# EAGLE design SAMD51_SoundHub_Pro_1.0.0_may2023 (EAGLE 9.6.2)
COMPANY: ADAFRUIT INDUSTRIES; DRAWN: KTOWN; REV: B

## Sheet 1 of 3
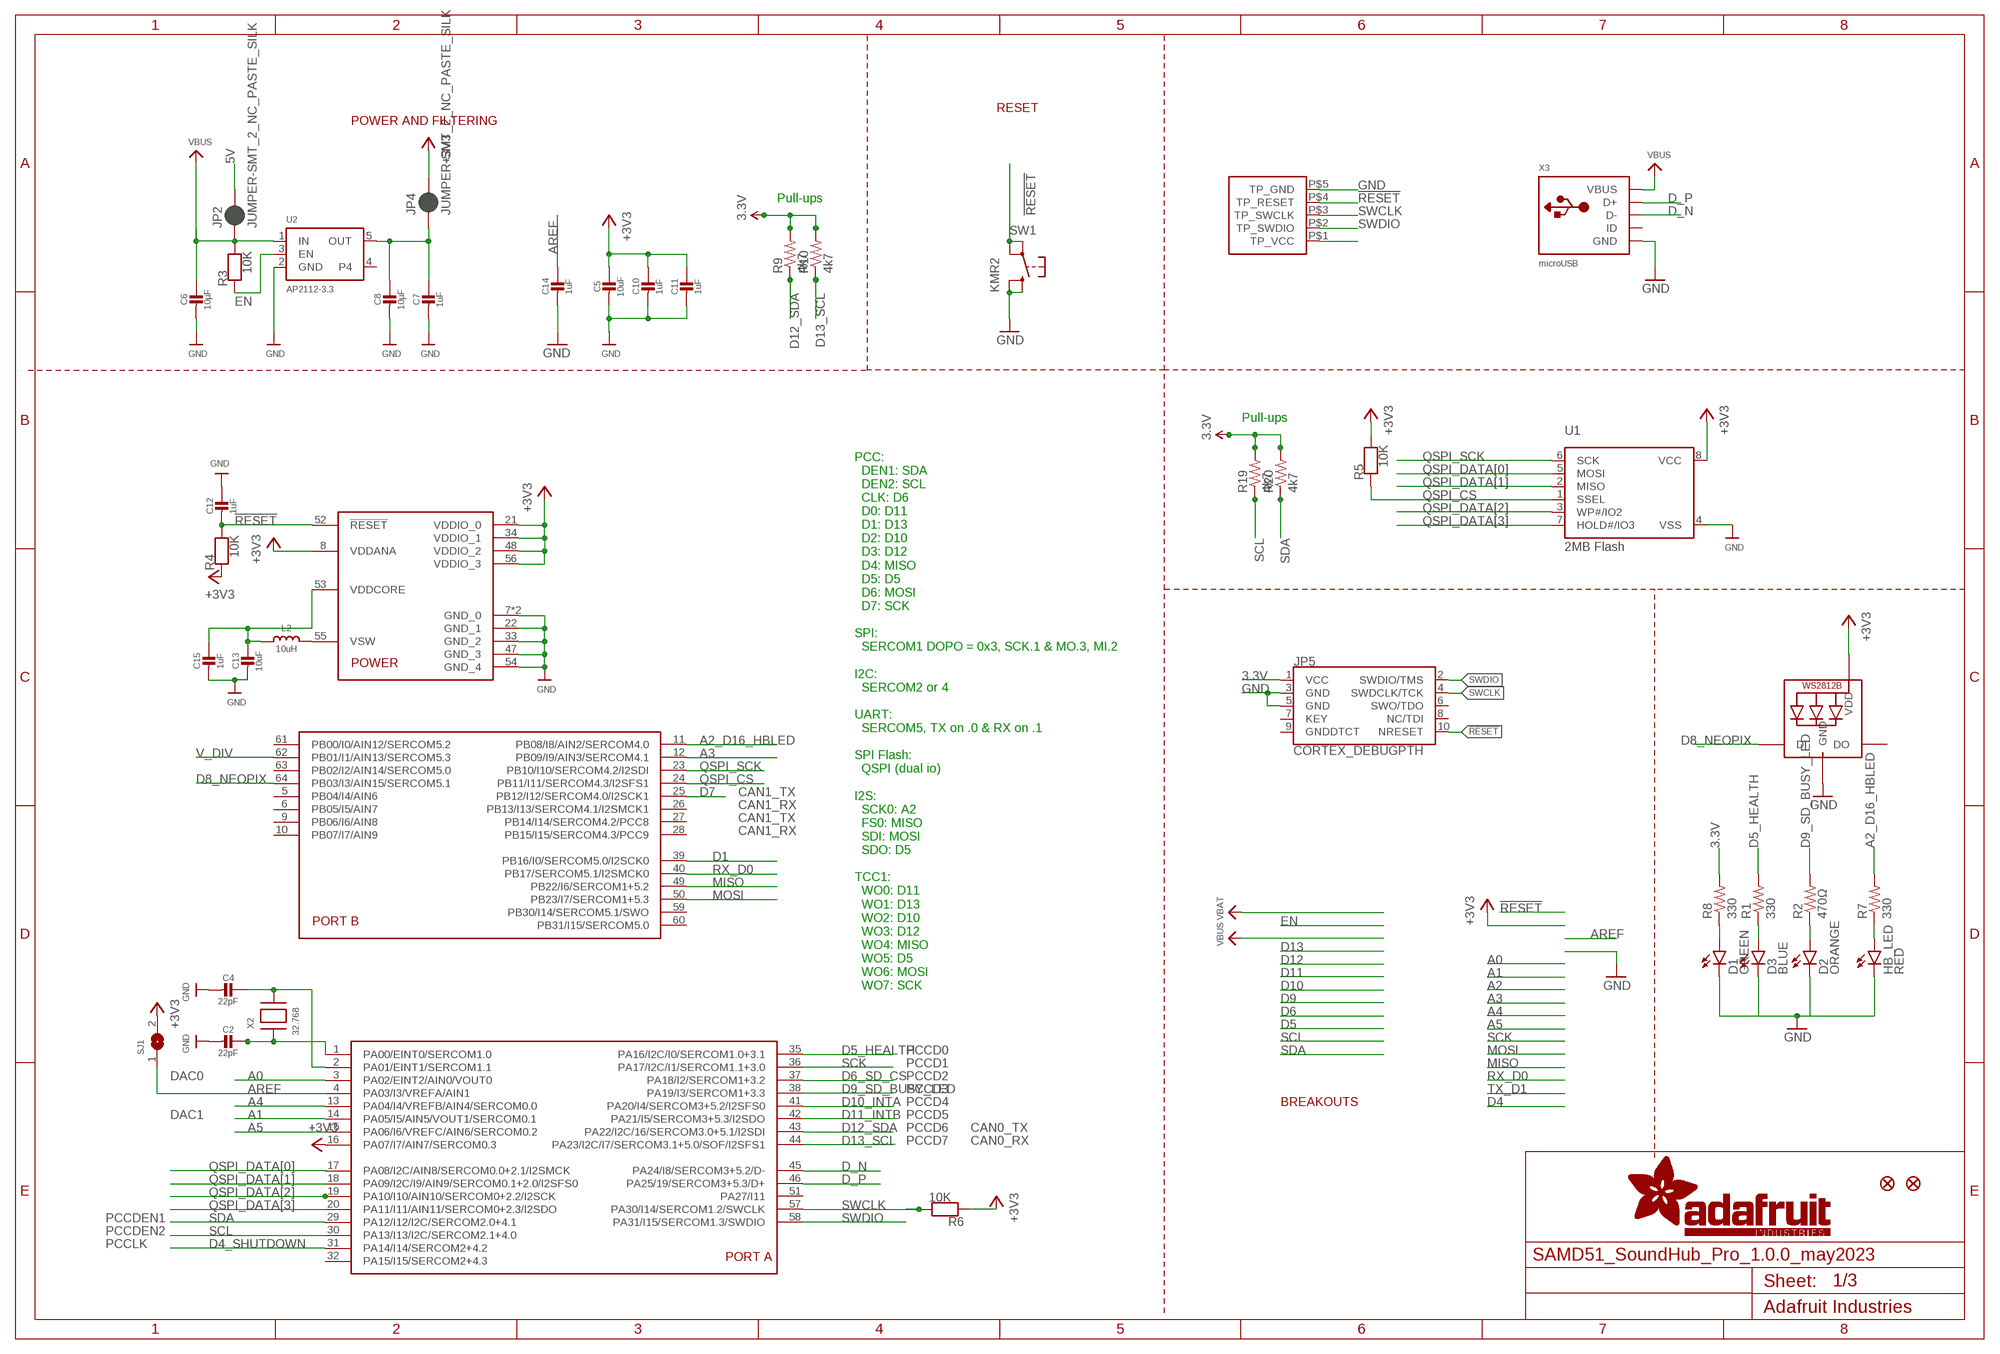
[diagram p0: schematic, sheet 1]

### Parts
C2  22pF  CAP_CERAMIC0603_NO  [0603-NO]
C4  22pF  CAP_CERAMIC0603_NO  [0603-NO]
C5  10uF  CAP_CERAMIC0805-NOOUTLINE  [0805-NO]
C6  10µF  CAP_CERAMIC0805-NOOUTLINE  [0805-NO]
C7  1uF  CAP_CERAMIC0603_NO  [0603-NO]
C8  10µF  CAP_CERAMIC0805-NOOUTLINE  [0805-NO]
C10  1uF  CAP_CERAMIC0603_NO  [0603-NO]
C11  1uF  CAP_CERAMIC0603_NO  [0603-NO]
C12  1uF  CAP_CERAMIC0603_NO  [0603-NO]
C13  10uF  CAP_CERAMIC0805-NOOUTLINE  [0805-NO]
C14  1uF  CAP_CERAMIC0603_NO  [0603-NO]
C15  1uF  CAP_CERAMIC0603_NO  [0603-NO]
D1  GREEN  LED-BLUE0603  [LED-0603@1]
D2  ORANGE  LED-RED0603  [LED-0603]
D3  BLUE  LED-BLUE0603  [LED-0603@1]
HB_LED  RED  LED-RED0603  [LED-0603]
JP2  JUMPER-SMT_2_NC_PASTE_SILK  [SMT-JUMPER_2_NC_PASTE_SILK]
JP4  JUMPER-SMT_2_NC_PASTE_SILK  [SMT-JUMPER_2_NC_PASTE_SILK]
JP5  CORTEX_DEBUGPTH  [2X5-PTH-1.27MM]
L2  10uH  INDUCTOR  [INDUCTOR_1007]
LED1  WS2812B3535  [LED3535]
R1  330  330OHM1/10W1%(0603)  [0603-RES]
R2  470Ω  330OHM1/10W1%(0603)  [0603-RES]
R3  10K  RESISTOR_0603_NOOUT  [0603-NO]
R4  10K  RESISTOR_0603_NOOUT  [0603-NO]
R5  10K  RESISTOR_0603_NOOUT  [0603-NO]
R6  10K  RESISTOR_0603_NOOUT  [0603-NO]
R7  330  330OHM1/10W1%(0603)  [0603-RES]
R8  330  330OHM1/10W1%(0603)  [0603-RES]
R9  4k7  47KOHM1/10W1%(0603)  [0603-RES]
R10  4k7  47KOHM1/10W1%(0603)  [0603-RES]
R19  4k7  47KOHM1/10W1%(0603)  [0603-RES]
R20  4k7  47KOHM1/10W1%(0603)  [0603-RES]
SJ1  SOLDERJUMPERCLOSED  [SOLDERJUMPER_CLOSEDWIRE]
SW1  KMR2  SWITCH_TACT_SMT4.6X2.8  [BTN_KMR2_4.6X2.8]
U1  2MB Flash  SPIFLASH_8PINUX  [USON8]
U2  AP2112-3.3  VREG_SOT23-5  [SOT23-5]
U$12  HUB_TESTPINSHUBS  [TEST_PINS]
U$14  ATSAMD51J  [PQFN64-1]
U$34  FIDUCIAL_1MM  [FIDUCIAL_1MM]
U$35  FIDUCIAL_1MM  [FIDUCIAL_1MM]
X2  32.768  XTAL-3.2X1.5  [XTAL3215]
X3  microUSB  USB_MICRO_20329_V2  [4UCONN_20329_V2]

### Nets
3.3V: C5.1 C10.1 C11.1 JP4.2 JP5.1(VCC) LED1.2(VDD) R4.1 R5.2 R6.1 R8.2 R9.2 R10.2 R19.2 R20.2 SJ1.2 U1.8(VCC) U$12.P$1(TP_VCC) U$14.8(VDDANA) U$14.16(PA07/I7/AIN7/SERCOM0.3) U$14.21(VDDIO_0) U$14.34(VDDIO_1) U$14.48(VDDIO_2) U$14.56(VDDIO_3) ; supply symbol labelled +3V3 ; also sheet 2
5V: JP2.2 ; also sheet 2
!RESET: C12.2 JP5.10(NRESET) R4.2 SW1.A'(P1) SW1.A(P) U$12.P$4(TP_RESET) U$14.52(!RESET)
A0: U$14.3(PA02/EINT2/AIN0/VOUT0) ; also sheet 2
A1: U$14.14(PA05/I5/AIN5/VOUT1/SERCOM0.1) ; also sheet 2
A2_D16_HBLED: R7.2 U$14.11(PB08/I8/AIN2/SERCOM4.0)
A3: U$14.12(PB09/I9/AIN3/SERCOM4.1)
A4: U$14.13(PA04/I4/VREFB/AIN4/SERCOM0.0)
A5: U$14.15(PA06/I6/VREFC/AIN6/SERCOM0.2)
AREF: C14.1 SJ1.1 U$14.4(PA03/I3/VREFA/AIN1)
D1: U$14.39(PB16/I0/SERCOM5.0/I2SCK0)
D4_SHUTDOWN: U$14.31(PA14/I14/SERCOM2+4.2) ; also sheet 2
D5_HEALTH: R1.2 U$14.35(PA16/I2C/I0/SERCOM1.0+3.1)
D5_HEALTH_LED: D3.A R1.1
D5_HEALTH_LED1: D1.A R8.1
D6_SD_CS: U$14.37(PA18/I2/SERCOM1+3.2) ; also sheet 2
D7: U$14.25(PB12/I12/SERCOM4.0/I2SCK1) ; also sheet 2
D8_NEOPIX: LED1.1(DI) U$14.64(PB03/I3/AIN15/SERCOM5.1)
D9_SD_BUSY_LED: R2.2 U$14.38(PA19/I3/SERCOM1+3.3)
D10_INTA: U$14.41(PA20/I4/SERCOM3+5.2/I2SFS0) ; also sheet 2
D11_INTB: U$14.42(PA21/I5/SERCOM3+5.3/I2SDO) ; also sheet 2
D12_SDA: R9.1 U$14.43(PA22/I2C/16/SERCOM3.0+5.1/I2SDI) ; also sheet 2
D13_SCL: R10.1 U$14.44(PA23/I2C/I7/SERCOM3.1+5.0/SOF/I2SFS1) ; also sheet 2
D14_HB_LED: HB_LED.A R7.1
D_N: U$14.45(PA24/I8/SERCOM3+5.2/D-) X3.D-
D_P: U$14.46(PA25/19/SERCOM3+5.3/D+) X3.D+
EN: R3.1 U2.3(EN)
GND [gnd]: C2.2 C4.2 C5.2 C6.2 C7.2 C8.2 C10.2 C11.2 C12.1 C13.2 C14.2 C15.2 D1.C HB_LED.C JP5.3(GND) JP5.5(GND) LED1.4(GND) SW1.B'(S1) SW1.B(S) U1.4(VSS) U2.2(GND) U$12.P$5(TP_GND) U$14.7(GND_0) U$14.22(GND_1) U$14.33(GND_2) U$14.47(GND_3) U$14.54(GND_4) U$14.EXP(GND_0) X3.BASE@1(GND) X3.BASE@2(GND) X3.GND X3.SPRT@1(GND) X3.SPRT@2(GND) X3.SPRT@3(GND) X3.SPRT@4(GND) ; also sheet 2
MISO: U$14.49(PB22/I6/SERCOM1+5.2) ; also sheet 2
MOSI: U$14.50(PB23/I7/SERCOM1+5.3) ; also sheet 2
N$1: D2.A R2.1
N$3: D3.C
N$5: C2.1 U$14.1(PA00/EINT0/SERCOM1.0) X2.P$1
N$6: D2.C
N$7: C4.1 U$14.2(PA01/EINT1/SERCOM1.1) X2.P$2
N$11: L2.P$2 U$14.55(VSW)
OUT [power]: C7.1 C8.1 JP4.1 U2.5(OUT)
QSPI_CS: R5.1 U1.1(SSEL) U$14.24(PB11/I11/SERCOM4.3/I2SFS1)
QSPI_DATA[0]: U1.5(MOSI) U$14.17(PA08/I2C/AIN8/SERCOM0.0+2.1/I2SMCK)
QSPI_DATA[1]: U1.2(MISO) U$14.18(PA09/I2C/I9/AIN9/SERCOM0.1+2.0/I2SFS0)
QSPI_DATA[2]: U1.3(WP#/IO2) U$14.19(PA10/I10/AIN10/SERCOM0+2.2/I2SCK)
QSPI_DATA[3]: U1.7(HOLD#/IO3) U$14.20(PA11/I11/AIN11/SERCOM0+2.3/I2SDO)
QSPI_SCK: U1.6(SCK) U$14.23(PB10/I10/SERCOM4.2/I2SDI)
RX_D0: U$14.40(PB17/SERCOM5.1/I2SMCK0)
SCK: U$14.36(PA17/I2C/I1/SERCOM1.1+3.0) ; also sheet 2
SCL: R19.1 U$14.30(PA13/I13/I2C/SERCOM2.1+4.0) ; also sheet 2
SDA: R20.1 U$14.29(PA12/I12/I2C/SERCOM2.0+4.1) ; also sheet 2
SWCLK: JP5.4(SWDCLK/TCK) R6.2 U$12.P$3(TP_SWCLK) U$14.57(PA30/I14/SERCOM1.2/SWCLK)
SWDIO: JP5.2(SWDIO/TMS) U$12.P$2(TP_SWDIO) U$14.58(PA31/I15/SERCOM1.3/SWDIO)
V_DIV: U$14.62(PB01/I1/AIN13/SERCOM5.3)
VBUS [power]: C6.1 JP2.1 R3.2 U2.1(IN) X3.VBUS
VDDCORE1: C13.1 C15.1 L2.P$1 U$14.53(VDDCORE)
Unconnected: JP5.6(SWO/TDO) JP5.7(KEY) JP5.8(NC/TDI) JP5.9(GNDDTCT) LED1.3(DO) U2.4 U$14.5(PB04/I4/AIN6) U$14.6(PB05/I5/AIN7) U$14.9(PB06/I6/AIN8) U$14.10(PB07/I7/AIN9) U$14.26(PB13/I13/SERCOM4.1/I2SMCK1) U$14.27(PB14/I14/SERCOM4.2/PCC8) U$14.28(PB15/I15/SERCOM4.3/PCC9) U$14.32(PA15/I15/SERCOM2+4.3) U$14.51(PA27/I11) U$14.59(PB30/I14/SERCOM5.1/SWO) U$14.60(PB31/I15/SERCOM5.0) U$14.61(PB00/I0/AIN12/SERCOM5.2) U$14.63(PB02/I2/AIN14/SERCOM5.0) X3.ID

### Notes on the sheet
- RESET
- POWER AND FILTERING
- Pull-ups
- Pull-ups
- CAN1_TX
- CAN1_RX
- CAN1_TX
- CAN1_RX
- PCC:
    DEN1: SDA
    DEN2: SCL
    CLK: D6
    D0: D11
    D1: D13
    D2: D10
    D3: D12
    D4: MISO
    D5: D5
    D6: MOSI
    D7: SCK
  
  SPI:
    SERCOM1 DOPO = 0x3, SCK.1 & MO.3, MI.2
  
  I2C:
    SERCOM2 or 4
  
  UART:
    SERCOM5, TX on .0 & RX on .1
  
  SPI Flash:
    QSPI (dual io)
  
  I2S:
    SCK0: A2
    FS0: MISO
    SDI: MOSI
    SDO: D5
  
  TCC1:
    WO0: D11
    WO1: D13
    WO2: D10
    WO3: D12
    WO4: MISO
    WO5: D5
    WO6: MOSI
    WO7: SCK
- PCCD0
- PCCD1
- DAC0 | PCCD2
- PCCD3
- PCCD4 | BREAKOUTS
- DAC1 | PCCD5
- PCCD6 | CAN0_TX
- PCCD7 | CAN0_RX
- PCCDEN1
- PCCDEN2
- PCCLK

## Sheet 2 of 3
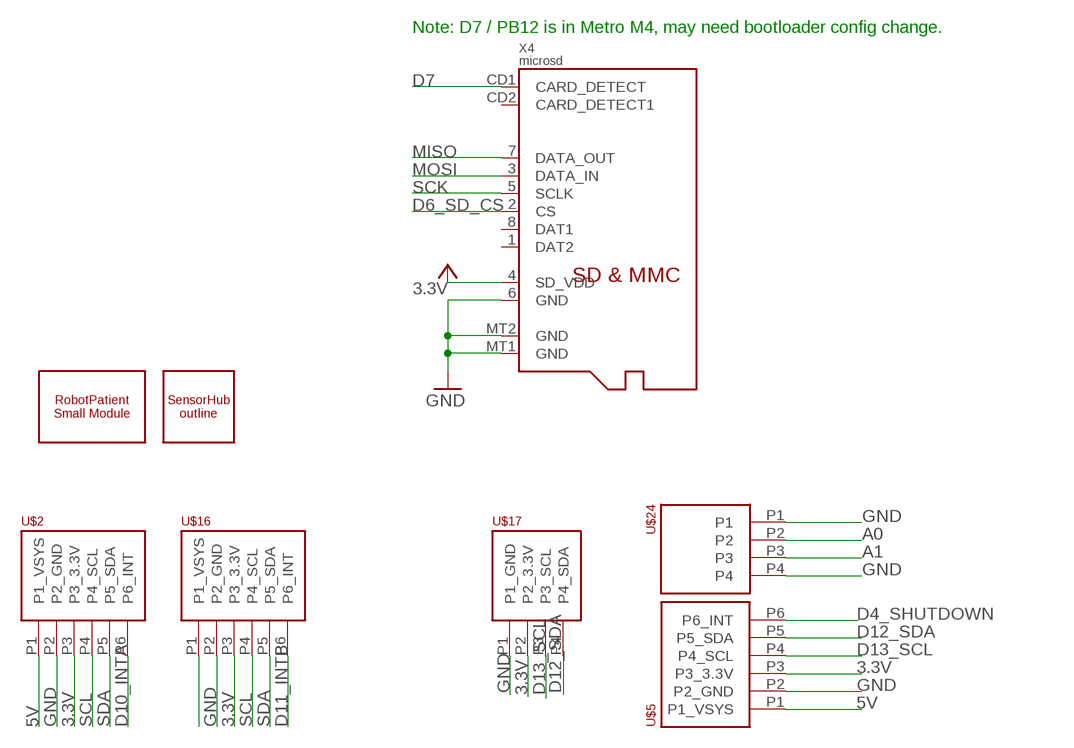
[diagram p1: schematic, sheet 2]

### Parts
U$2  PHOENIX_PTSM_M6_TH_I2CPPANGLE  [PTSM_M6_THRHOLE]
U$5  PHOENIX_PTSM_M6_TH_I2CPPANGLE  [PTSM_M6_THRHOLE]
U$7  SENSORHUB_PROFILEUSB_LEFT  [SENSORHUB_OUTLINE_USB_NOTCH_LEFT]
U$9  ROBOTPATIENT_SMALL_MODULEOUTLINE  [ROBOTPATIENT_SMALL]
U$16  PHOENIX_PTSM_M6_TH_I2CPPANGLE  [PTSM_M6_THRHOLE]
U$17  PHOENIX_PTSM_M4_THANGLE  [PTSM_M4_TH]
U$24  PHOENIX_PTSM_M4_TH_ANGLE  [PTSM_M4_TH_ANGLE_NEUTRAL]
X4  microsd  MICROSD  [MICROSD]

### Nets
3.3V: U$2.P3(P3_3.3V) U$5.P3(P3_3.3V) U$16.P3(P3_3.3V) U$17.P2(P2_3.3V) X4.4(SD_VDD) ; supply symbol labelled +3V3 ; also sheet 1
5V: U$2.P1(P1_VSYS) U$5.P1(P1_VSYS) U$16.P1(P1_VSYS) ; also sheet 1
A0: U$24.P2 ; also sheet 1
A1: U$24.P3 ; also sheet 1
D4_SHUTDOWN: U$5.P6(P6_INT) ; also sheet 1
D6_SD_CS: X4.2(CS) ; also sheet 1
D7: X4.CD1(CARD_DETECT) ; also sheet 1
D10_INTA: U$2.P6(P6_INT) ; also sheet 1
D11_INTB: U$16.P6(P6_INT) ; also sheet 1
D12_SDA: U$5.P5(P5_SDA) U$17.P4(P4_SDA) ; also sheet 1
D13_SCL: U$5.P4(P4_SCL) U$17.P3(P3_SCL) ; also sheet 1
GND [gnd]: U$2.P2(P2_GND) U$5.P2(P2_GND) U$16.P2(P2_GND) U$17.P1(P1_GND) U$24.P1 U$24.P4 X4.6(GND) X4.MT1(GND) X4.MT2(GND) ; also sheet 1
MISO: X4.7(DATA_OUT) ; also sheet 1
MOSI: X4.3(DATA_IN) ; also sheet 1
SCK: X4.5(SCLK) ; also sheet 1
SCL: U$2.P4(P4_SCL) U$16.P4(P4_SCL) ; also sheet 1
SDA: U$2.P5(P5_SDA) U$16.P5(P5_SDA) ; also sheet 1
Unconnected: X4.1(DAT2) X4.8(DAT1) X4.CD2(CARD_DETECT1)

### Notes on the sheet
- Note: D7 / PB12 is in Metro M4, may need bootloader config change.

## Sheet 3 of 3

## Library data of the parts
C2 C4-C7 C10-C15 = microbuilder:CAP_CERAMIC: Ceramic Capacitors For new designs, use the packages preceded by an '_' character since they are more reliable: The following footprints should be used on most boards: _0402 - Standard footprint for regular board layouts _0603 - Standard footprint for regular board layouts _0805 - Standard footprint for regular board layouts _1206 - Standard footprint for regular board layouts For extremely tight-pitch boards where space is at a premium, the following 'micro-pitch' footprints can be used (smaller pads, no silkscreen outline, etc.): _0402MP - Micro-pitch footprint for very dense/compact boards _0603MP - Micro-pitch footprint for very dense/compact boards _0805MP - Micro-pitch footprint for very dense/compact boards _1206MP - Micro-pitch footprint for very dense/compact boards
C8 = microbuilder:CAP_CERAMIC: Ceramic Capacitors For new designs, use the packages preceded by an '_' character since they are more reliable: The following footprints should be used on most boards: _0402 - Standard footprint for regular board layouts _0603 - Standard footprint for regular board layouts _0805 - Standard footprint for regular board layouts _1206 - Standard footprint for regular board layouts For extremely tight-pitch boards where space is at a premium, the following 'micro-pitch' footprints can be used (smaller pads, no silkscreen outline, etc.): _0402MP - Micro-pitch footprint for very dense/compact boards _0603MP - Micro-pitch footprint for very dense/compact boards _0805MP - Micro-pitch footprint for very dense/compact boards _1206MP - Micro-pitch footprint for very dense/compact boards; REV: E
D1 = SparkFun-LED:LED-BLUE: Blue LEDs for production use Various blue LEDs stocked by SparkFun production 0603 - DIO-08575 Rebel - DIO-09553 1206 - DIO-09911; PROD_ID: DIO-08575; VALUE: BLUE
D2 = SparkFun-LED:LED-RED: Red SMD LED Used in manufacturing of most products at SparkFun Packages: 0603 - SMD 0603 package [Product Link] <http://docs.avagotech.com/docs/AV02-0551EN> 0603 SMART - SMD 0603 SMART package ( more efficient and expensive)[Product Link] <http://www.osram-os.com/Graphics/XPic2/00077099_0.pdf> 1206 - SMD1206 package [Product Link] <https://www.sparkfun.com/datasheets/DevTools/LilyPad/Q150OVS4.pdff> SparkFun Products: Pro Mini 328 -5V <https://www.sparkfun.com/products/821> RedBoard <https://www.sparkfun.com/products/12757> IOIO-OTG <https://www.sparkfun.com/products/13613>; PROD_ID: DIO-00819; VALUE: RED
D3 = SparkFun-LED:LED-BLUE: Blue LEDs for production use Various blue LEDs stocked by SparkFun production 0603 - DIO-08575 Rebel - DIO-09553 1206 - DIO-09911; PROD_ID: DIO-08575
HB_LED = SparkFun-LED:LED-RED: Red SMD LED Used in manufacturing of most products at SparkFun Packages: 0603 - SMD 0603 package [Product Link] <http://docs.avagotech.com/docs/AV02-0551EN> 0603 SMART - SMD 0603 SMART package ( more efficient and expensive)[Product Link] <http://www.osram-os.com/Graphics/XPic2/00077099_0.pdf> 1206 - SMD1206 package [Product Link] <https://www.sparkfun.com/datasheets/DevTools/LilyPad/Q150OVS4.pdff> SparkFun Products: Pro Mini 328 -5V <https://www.sparkfun.com/products/821> RedBoard <https://www.sparkfun.com/products/12757> IOIO-OTG <https://www.sparkfun.com/products/13613>; PROD_ID: DIO-00819
JP2 JP4 = SparkFun-Jumpers:JUMPER-SMT_2_NC_PASTE: Normally closed solder jumper This jumper has an aperture in the stencil to allow solder paste to bridge the split in the wire so it's normally closed (NC). Wick off the solder to open the connection. Reapply solder to reclose the connection.
JP5 = samd21-temp:CORTEX_DEBUG: Cortex Debug Connector Datasheet <http://infocenter.arm.com/help/topic/com.arm.doc.faqs/attached/13634/cortex_debug_connectors.pdf>
L2 = microbuilder:INDUCTOR: Inductors 0603: 10nH Ceramic Inductor - microwire antenna/RF (Digikey: 712-1434-2-ND) 0805: 560nH Ceramic Inductor - RF (Digikey: 553-1047-1-ND) 270nH Ceramic Inductor - Q = 40@250MHz, +-5%, 1 Ohm DC Resistance (Digikey: 535-10506-2-ND) 1007 (2518 Metric) SMT: 10µH 10% 250mOhm 820mA 1007 Inductor (Digikey: 587-2189-1-ND) 22µH 10% 500mOhm 580mA 1007 Inductor (Digikey: 587-2190-1-ND) 47µH 10% 950mOhm 420mA 1007 Inductor (Digikey: 587-2191-1-ND) 47µH 5% 100mOhm 1A 1008 Inductor (Digikey: 732-1816-1-ND) 5.0x5.0mm (Taiyo Yuden NR5040 Series) 6.8µH 20% 2.3A 64mOhm Inductor (Digikey: 587-2374-2-ND) 5.0x5.0mm (TDK VLC5045 Series) 4.7µH 20% 3.3A 34mOhm Inductor (Digikey: 445-6526-1-ND) 6.8µH 20% 2.7A 46mOhm Inductor (Digikey: 445-6527-1-ND) 6.0x6.0mm (TDK VLC6045 Series) 4.7µH 20% 3.8A 27mOhm Inductor (Digikey: 445-6538-2-ND) 6.8µH 20% 3A 41mOhm Inductor (Digikey: 445-6540-1-ND) 6.2µH 30% 2.2A 45mOhm Inductor (Digikey: SRR5028-6R2YCT-ND) - Not TDK VLC6045 but footprint should match 6.0x6.0mm (TDK SLF6045 Series) 6.8uH 30% 2A 33mOhm Inductor (Digikey: 445-4572-1-ND, Mouser: 810-SLF645T6R8N2R0PF) 6.0x6.0mm (Sumida CDRH5D28 Series) 6.2uH 30% 1.8A 45mOhm Inductor (Digikey: 308-1542-1-ND) Taiyo Yuden NR3015T2R2M - 2.2uH 20% 1.5A (Digikey: 587-1648-2-ND, Mouser: 963-NR3015T2R2M) - Used with TI TPS62172 CoilCraft RFID Transponder Coil - MA5532-AE (For use with AS3935 Lightning Sensor) Taiyo Yuden NRH2412T2R2MNGH - 2.2uH 20% 1AA (Digikey: 587-3443-1-ND) - Used with TI LM3671 Vishay IHLP 1.0uH Molded Inductor - 24mOhm DCR, 5A, +/-20%, -55°C-125°C (Digikey: 541-1319-1-ND)
LED1 = microbuilder:WS2812B
R1 R7 R8 = SparkFun-Resistors:330OHM1/10W1%(0603): RES-00818; PROD_ID: RES-00818
R2 = SparkFun-Resistors:330OHM1/10W1%(0603): RES-00818; PROD_ID: RES-00818; VALUE: 330
R3-R6 = microbuilder:RESISTOR: Resistors For new designs, use the packages preceded by an '_' character since they are more reliable: The following footprints should be used on most boards: _0402 - Standard footprint for regular board layouts _0603 - Standard footprint for regular board layouts _0805 - Standard footprint for regular board layouts _1206 - Standard footprint for regular board layouts For extremely tight-pitch boards where space is at a premium, the following 'micro-pitch' footprints can be used (smaller pads, no silkscreen outline, etc.): _0402MP - Micro-pitch footprint for very dense/compact boards _0603MP - Micro-pitch footprint for very dense/compact boards _0805MP - Micro-pitch footprint for very dense/compact boards _1206MP - Micro-pitch footprint for very dense/compact boards
R9 R10 R19 R20 = SparkFun-Resistors:47KOHM1/10W1%(0603): RES-07871; PROD_ID: RES-07871; VALUE: 47K
SJ1 = microbuilder:SOLDERJUMPER: SMD Solder JUMPER Solder the two pads together to create a connection, or remove the solder to break it. REFLOW - Use this footprint for solder paste and reflow ovens. WAVE - Use this footprint for hand-soldering (larger pads). CLOSED - Has a trace between the two pads to ensure it is closed by default. The trace needs to be cut to disable the jumper, and can be closed again by creating a solder bridge between the two pads.
SW1 = microbuilder:SWITCH_TACT_SMT: SMT Tact Switches 6x6mm - Digikey: P12940SCT-ND KMR2 (4.6x2.8mm) - Digikey: 401-1426-1-ND EVQ-PQHB55 - Light Touch, 160GF (4.5x4.5mm) - Digikey: P8090SCT-ND KMT0 - KMT021 NGJ LHS (etc.) IP68/Waterproof - Digikey: CKN10289CT-ND
U1 = microbuilder:SPIFLASH_8PIN: SOIC8 SPI Flash Be careful with the size since SOIC8 flash comes in several 'widths' SOIC8 150 mil M25P16 - 16Mbit (2Mbit x 8) Serial Flash (75MHz SPI Bus), Supply: 2.7-3.6V Digikey: SOIC8 - M25P16-VMN6P-ND SOIC8 208 mil W25Q16BVSSIG - 16Mbit (2Mbit x 8) Serial Flash (104MHz SPI Bus), Supply: 2.7-3.6V Digikey: SOIC8 - W25Q16BVSSIG-ND
U2 = microbuilder:VREG_SOT23-5: SOT23-5 Fixed Voltage Regulators Part Current Out V Out V In V Dropout θJA (°C/W) TJ (°C) Digikey Part No. ADP121 150mA 3.3V 3.4-5.5V 0.09V @ 150mA -- -- ADP121-AUJZ33R7CT-ND ADP121 150mA 3.0V 3.1-5.5V 0.09V @ 150mA -- -- ADP121-AUJZ30R7CT-ND ADP122 300mA 3.3V 3.4-5.5V 0.085V @ 300mA -- -- ADP122AUJZ-3.3-R7CT-ND ADP1712 300mA 3.3V 3.5-5.5V 0.17V @ 300mA -- -- ADP1712AUJZ-3.3-R7TR-ND AP7311 (Low Cost) 150mA 3.3V 3.5-6V 0.15V @ 150mA -- -- AP7311-33WG-7DICT-ND LD39015M18R 150mA 1.8V 1.9V-5.5V 0.08V @ 100mA -- -- 497-6977-1-ND LP2985A-33DBVR 150mA 3.3V 3.3-16V 0.28V @ 150mA 206 150 296-18479-1-ND MCP1824T-3302E/OT 300mA 3.3V 3.5V-6V 0.2V @ 300mA -- -- MCP1824T-3302E/OTCT-ND MIC5205-2.5YM5 TR 150mA 2.5V 2.7-16V 0.165V @ 150mA -- -- 576-1257-2-ND MIC5205-3.0YM5 TR 150mA 3.0V 3.2V-16V 0.165V @ 150mA -- -- 576-1258-2-ND MIC5205-3.3YM5 TR 150mA 3.3V 3.5V-16V 0.165V @ 150mA -- -- 576-1259-2-ND TPS780330220 150mA 3.3V+2.2V 3.6-5.5V 250mV Max -- -- 296-23332-1-ND TDA3663/N1,135 100mA 3.3V 3.5-45V 0.18V @ 50mA -- -- 568-5343-1-ND Max operating temp can be calculated using θJA, TJ (max junction temperature), and power in watts. Set the "Maximum Ambient Temperature" until it reaches TJ ("Max Junction Temperature"), which is the absolute limit for safe use of the regulator: Heat Sink Temperature Calculator <http://www.daycounter.com/Calculators/Heat-Sink-Temperature-Calculator.phtml> For example, With 12V source into a 3.3V LP2985 and a 30mA load, we are dissipating (12V-3.3V) * 0.03A = 0.261W. With a θJA of 206 °C/W, a TJ of 150°C, and 261mW we can safely use the chip without a heat sink up to 75°C (=147.1°C Junction Temperature).
U$2 U$5 U$16 = jk_customs:PHOENIX_PTSM_M6_TH_I2CPP
U$7 = jk_customs:SENSORHUB_PROFILE
U$9 = jk_customs:ROBOTPATIENT_SMALL_MODULE
U$12 = jk_customs:HUB_TESTPINS
U$14 = microbuilder:ATSAMD51J: ATSAMD51J cortex m4 microcontroller
U$17 = jk_customs:PHOENIX_PTSM_M4_TH
U$24 = jk_customs:PHOENIX_PTSM_M4_TH_ANGLE
U$34 U$35 = microbuilder:FIDUCIAL: Fiducial Alignment Points Various fiducial points for machine vision alignment.; BOM: EXCLUDE
X2 = adafruit2:XTAL: Low cost SMT crystals, no capacitors included http://www.ladyada.net/library/eagle
X3 = microbuilder:USB: USB Connectors USBMINIB - Surface Mount Female Mini-B USB Connector 4UConnector: 06564
X4 = microbuilder:MICROSD: MicroSD/Transflash Card Holder with SPI pinout 3M: 2908-05WB-MG 4UConnector: 19656 Footprint courtesy: Adafruit Industries

## Net classes
1 power: width 0.305 mm
2 gnd: width 0.254 mm

## Board
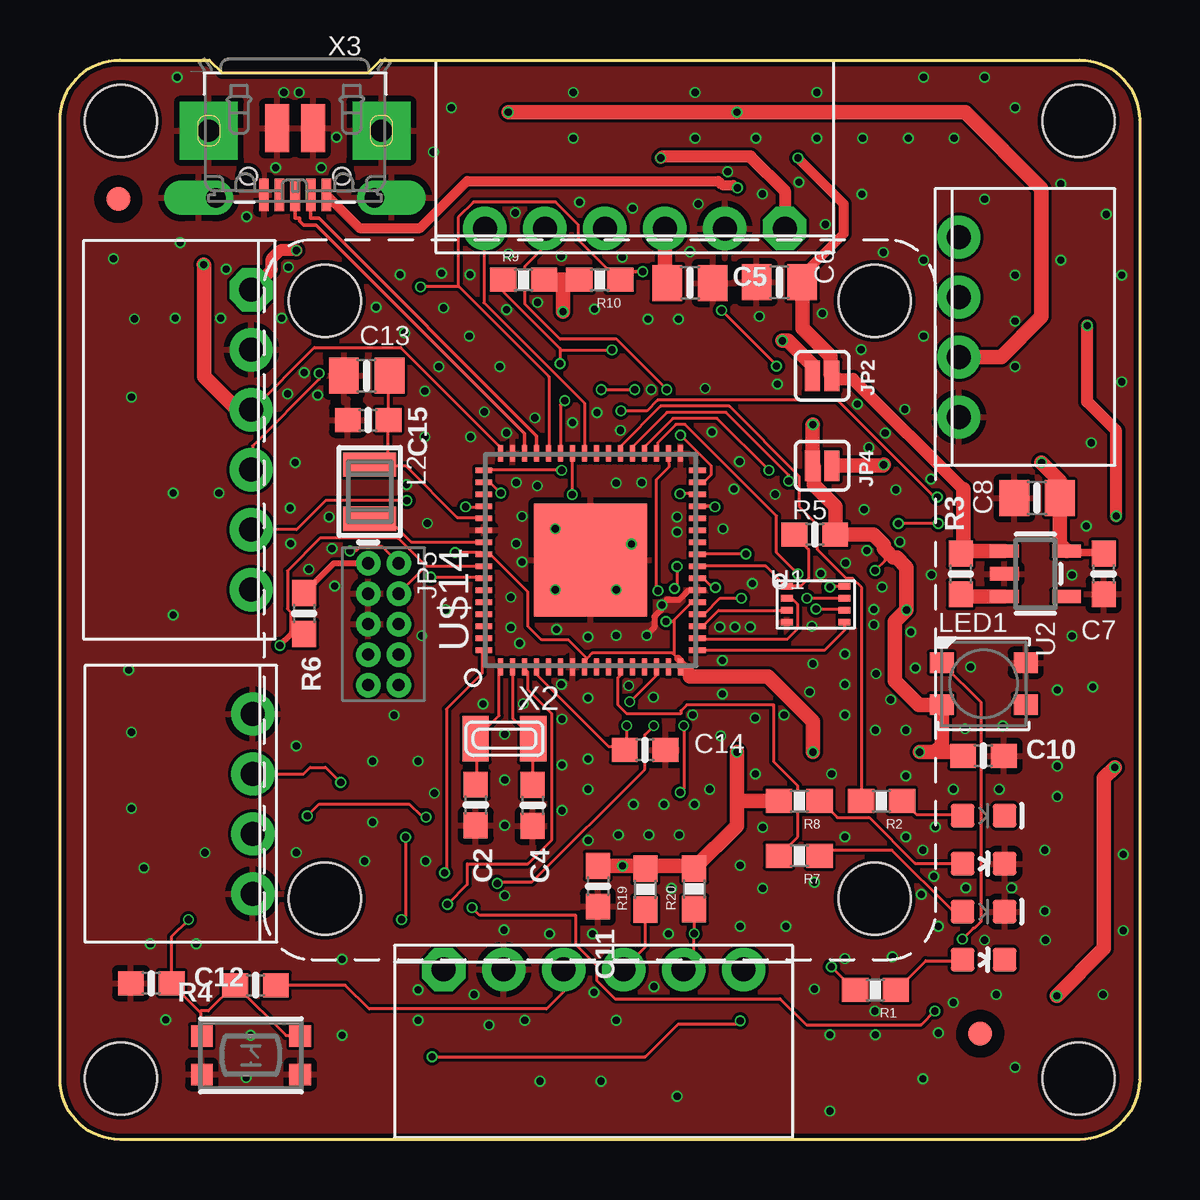
[diagram p2: board, top side]
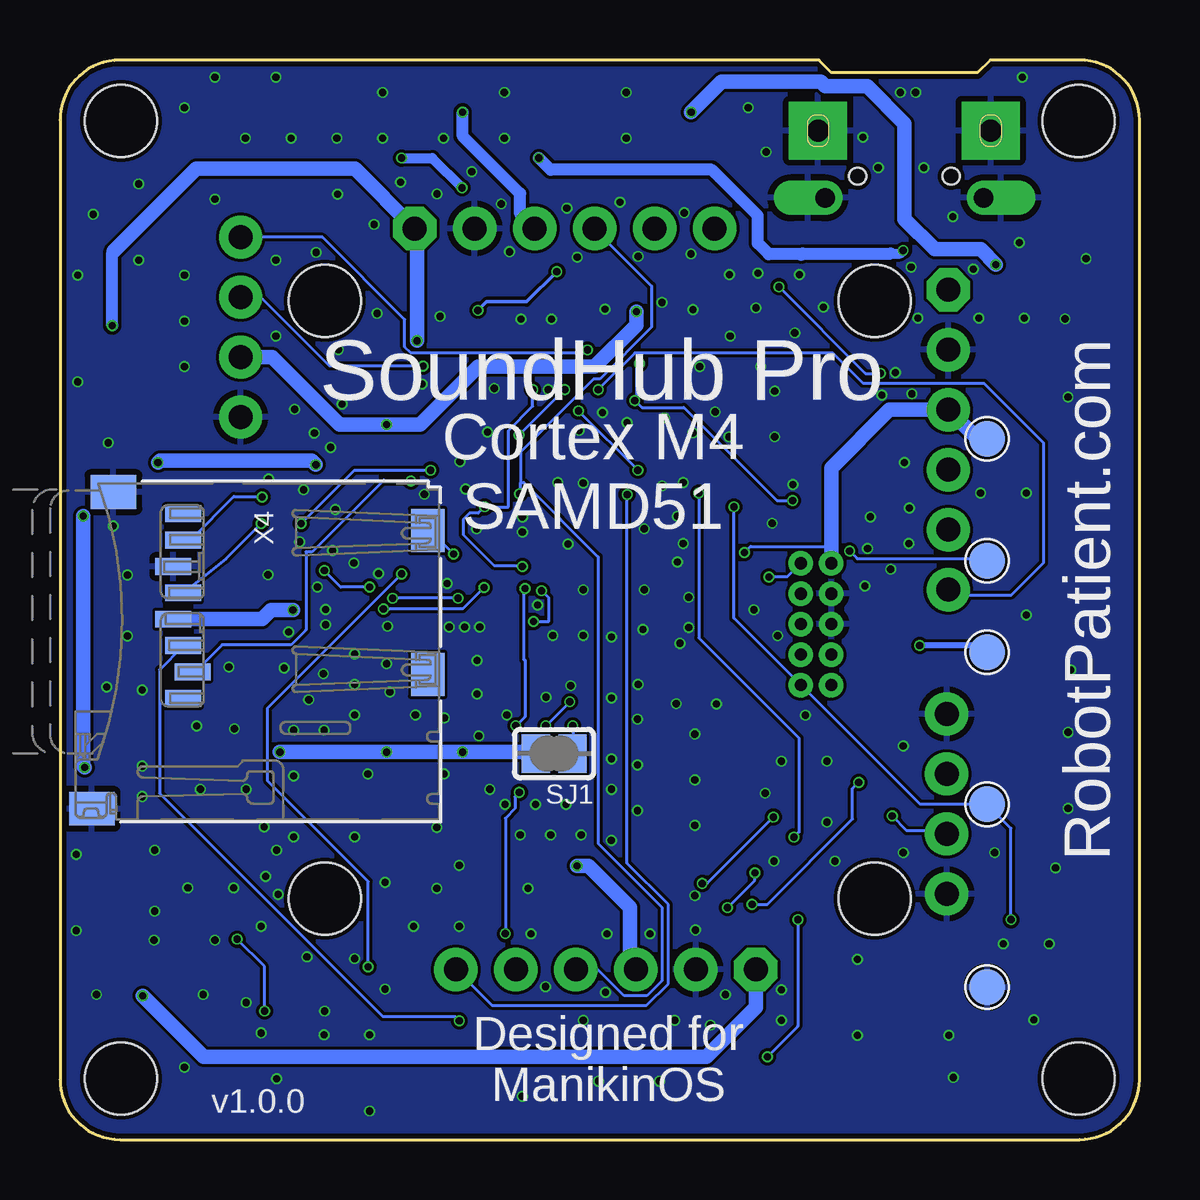
[diagram p3: board, bottom side, seen from below]

Size 45 x 45 mm. Coordinates in mm from the lower left corner, seen from the top.
Copper layers (1*16): Top 0.035mm / dielectric 1.6mm / Bottom 0.035mm
Design rules "jlcpcb-2layers_2023": minimum track width 5mil, minimum drill 0.3mm, track to track 5mil, track to pad 5mil, pad to pad 5mil, via to via 5mil, smd to smd 5mil, copper to edge 0.2mm, drill to drill 6mil, minimum pad ring 10mil, minimum via ring 3mil, stop-mask expansion 4mil, vias tented up to drill 20mil, thermal gap 10mil

### Footprints (pad centres in the part's own frame; a part is rotated, then mirrored left to right if it is on the bottom)
0603-NO = smd 1.075 x 1: 1 -0.85,0; 2 0.85,0
0805-NO = smd 1.24 x 1.5: 1 -0.95,0; 2 0.95,0
LED-0603@1 = smd 1 x 1: A 0,-0.877; C 0,0.877
LED-0603 = smd 1 x 1: A -0.877,0; C 0.877,0
SMT-JUMPER_2_NC_PASTE_SILK = smd 0.635 x 1.27: 1 -0.406,0; 2 0.406,0
2X5-PTH-1.27MM = drill 0.508 pad 1: 1 -2.54,-0.635; 2 -2.54,0.635; 3 -1.27,-0.635; 4 -1.27,0.635; 5 0,-0.635; 6 0,0.635; 7 1.27,-0.635; 8 1.27,0.635; 9 2.54,-0.635; 10 2.54,0.635
INDUCTOR_1007 = smd 1.016 x 2.2: P$1 -1.127,0; P$2 1.127,0
LED3535 = smd 1 x 0.85: 1 -1.75,0.875; 2 -1.75,-0.875; 3 1.75,-0.875; 4 1.75,0.875
0603-RES = smd 1.1 x 1: 1 -0.85,0; 2 0.85,0
SOLDERJUMPER_CLOSEDWIRE = smd 1.168 x 1.6: 1 -0.762,0; 2 0.762,0 | smd 0.635 x 0.203: WIRE 0,0
BTN_KMR2_4.6X2.8 = smd 0.9 x 0.9: A 2.05,0.8; A' -2.05,0.8; B 2.05,-0.8; B' -2.05,-0.8
USON8 = smd 0.5 x 0.275: 1 -1.2,0.75; 2 -1.2,0.25; 3 -1.2,-0.25; 4 -1.2,-0.75; 5 1.2,-0.75; 6 1.2,-0.25; 7 1.2,0.25; 8 1.2,0.75
SOT23-5 = smd 0.55 x 1.2: 1 -0.95,-1.3; 2 0,-1.3; 3 0.95,-1.3; 4 0.95,1.3; 5 -0.95,1.3
PTSM_M6_THRHOLE = drill 1 octagon: P1 6.25,1 | drill 1: P2 3.75,1; P3 1.25,1; P4 -1.25,1; P5 -3.75,1; P6 -6.25,1
SENSORHUB_OUTLINE_USB_NOTCH_LEFT = hole 3: -19.96,19.96; 19.96,19.96; -19.96,-19.96; 19.96,-19.96
ROBOTPATIENT_SMALL = hole 3: -11.455,12.455; 11.455,12.455; 11.455,-12.455; -11.455,-12.455
TEST_PINS = smd 1.5 x 1.5 bottom: P$1 6.35,29.21; P$2 6.35,24.13; P$3 6.35,20.32; P$4 6.35,13.97; P$5 6.35,6.35
PQFN64-1 = smd 0.7 x 0.22: 1 -4.45,3.75; 2 -4.45,3.25; 3 -4.45,2.75; 4 -4.45,2.25; 5 -4.45,1.75; 6 -4.45,1.25; 7 -4.45,0.75; 8 -4.45,0.25; 9 -4.45,-0.25; 10 -4.45,-0.75; 11 -4.45,-1.25; 12 -4.45,-1.75; 13 -4.45,-2.25; 14 -4.45,-2.75; 15 -4.45,-3.25; 16 -4.45,-3.75; 33 4.45,-3.75; 34 4.45,-3.25; 35 4.45,-2.75; 36 4.45,-2.25; 37 4.45,-1.75; 38 4.45,-1.25; 39 4.45,-0.75; 40 4.45,-0.25; 41 4.45,0.25; 42 4.45,0.75; 43 4.45,1.25; 44 4.45,1.75; 45 4.45,2.25; 46 4.45,2.75; 47 4.45,3.25; 48 4.45,3.75 | smd 0.22 x 0.7: 17 -3.75,-4.45; 18 -3.25,-4.45; 19 -2.75,-4.45; 20 -2.25,-4.45; 21 -1.75,-4.45; 22 -1.25,-4.45; 23 -0.75,-4.45; 24 -0.25,-4.45; 25 0.25,-4.45; 26 0.75,-4.45; 27 1.25,-4.45; 28 1.75,-4.45; 29 2.25,-4.45; 30 2.75,-4.45; 31 3.25,-4.45; 32 3.75,-4.45; 49 3.75,4.45; 50 3.25,4.45; 51 2.75,4.45; 52 2.25,4.45; 53 1.75,4.45; 54 1.25,4.45; 55 0.75,4.45; 56 0.25,4.45; 57 -0.25,4.45; 58 -0.75,4.45; 59 -1.25,4.45; 60 -1.75,4.45; 61 -2.25,4.45; 62 -2.75,4.45; 63 -3.25,4.45; 64 -3.75,4.45 | smd 4.7 x 4.7: EXP 0,0
PTSM_M4_TH = drill 1: P1 3.75,1; P2 1.25,1; P3 -1.25,1; P4 -3.75,1
PTSM_M4_TH_ANGLE_NEUTRAL = drill 1: P1 3.75,1; P2 1.25,1; P3 -1.25,1; P4 -3.75,1
FIDUCIAL_1MM = smd 1 x 1: 1 0,0
XTAL3215 = smd 1.1 x 1.9: P$1 1.2,0; P$2 -1.2,0
4UCONN_20329_V2 = smd 1 x 2: BASE@1 -0.75,-2; BASE@2 0.75,-2 | smd 0.4 x 1.35: D+ 0,0.775; D- -0.65,0.775; GND 1.3,0.775; ID 0.65,0.775; VBUS -1.3,0.775 | drill 0.8 pad 1.143 offset: SPRT@1 -3.3,0.9; SPRT@2 3.3,0.9 | drill 0.9 pad 2.413 square: SPRT@3 -3.6,-1.9; SPRT@4 3.6,-1.9 | hole 0.7: -1.95,0; 1.95,0
MICROSD = smd 0.7 x 1.5: 1 9,-10.64; 2 7.9,-10.24; 3 6.8,-10.64; 4 5.7,-11.04; 5 4.6,-10.64; 6 3.5,-11.04; 7 2.4,-10.64; 8 1.3,-10.64 | smd 1.8 x 1.4: CD1 2,-0.44; CD2 8,-0.44 | smd 1.4 x 1.9: MT1 0.4,-13.54; MT2 13.6,-14.44

### Placement (x,y rotation side)
C2  17.33,13.94 270 top
C4  19.71,13.93 270 top
C5  26.26,35.71 0 top
C6  29.99,35.73 180 top
C7  43.5,23.58 270 top
C8  40.73,26.74 180 top
C10  38.49,16 0 top
C11  22.42,10.56 270 top
C12  3.81,6.51 0 top
C13  12.78,31.83 180 top
C14  24.39,16.24 0 top
C15  12.85,29.99 180 top
D1  38.5,11.5 270 top
D2  38.5,13.5 0 top
D3  38.5,7.5 270 top
HB_LED  38.5,9.5 0 top
JP2  31.77,31.83 180 top
JP4  31.77,28.09 180 top
JP5  13.48,21.48 270 top
L2  12.91,27.01 270 top
LED1  38.5,19 0 top
R1  33.99,6.24 180 top
R2  34.25,14.12 180 top
R3  37.55,23.58 90 top
R4  8.15,6.43 180 top
R5  31.47,25.22 0 top
R6  10.18,21.93 270 top
R7  30.82,11.83 180 top
R8  30.82,14.12 180 top
R9  19.32,35.84 0 top
R10  22.5,35.84 180 top
R19  24.41,10.44 90 top
R20  26.44,10.45 90 top
SJ1  24.41,16.09 180 bottom
SW1  7.96,3.51 0 top
U1  31.5,22.31 0 top
U2  40.66,23.58 270 top
U$2  23.96,36.98 0 top
U$5  8.97,29.17 90 top
U$7  22.5,22.5 0 top
U$9  22.5,22.5 0 top
U$12  0,0 0 top
U$14  22.12,24.15 90 top
U$16  22.25,8.09 180 top
U$17  36.47,33.87 270 top
U$24  9.04,13.99 90 top
U$34  2.43,39.2 270 top
U$35  38.36,4.41 270 top
X2  18.52,16.71 180 top
X3  9.8,40.15 180 top
X4  29.23,27.39 270 bottom

### Tracks (layer width: path | path; a pad name or v marks a point on that pad's centre or on a via)
3.3V  (via drill 0.3)
  Top 0.127: U$14.48 18.31,28.66 18.31,28.91 14.21,33.02 10.6,33.02 8.02,30.44 U$5.P3 | 21.96,20.05 22.18,20.28 25.55,20.28 25.58,20.25 | 21.96,20.05 21.93,20.02 21.93,19.71 U$14.8 | 25.77,20.05 25.58,20.25 | 25.61,21.6 25.61,20.28 25.58,20.25 | 25.61,21.6 25.61,21.67 26.31,22.37 26.56,22.37 U$14.21 | 21.96,20.05 21.19,20.82 20.07,20.82 19.5,21.39 19.5,22.83 17.99,24.34 17.67,24.34 U$14.56 17.61,24.41 17.55,24.47 v16.47,24.47 | R4.1 11.9,6.43 12.89,5.44 20.28,5.44 21,6.16 U$16.P3 | v24.92,22.88 24.85,22.95 24.85,27.49 25.4,28.04 U$14.34 | 25.61,21.6 v25.26,21.6 | U1.8 32.12,23.06 v32.09,23.03 | v33.98,23.72 33.99,23.74 34.38,24.12 34.38,24.25 34.56,24.43
  Top 0.254: R6.1 11.43,24.02 JP5.1 | 25.77,20.05 26.3,19.52
  Top 0.305: U$14.16 26.05,19.52 26.3,19.52 | 26.26,19.31 U$14.16 | U$14.16 25.87,19.96 25.77,20.05
  Top 0.61: U$2.P3 25.21,35.81 C5.1 | R9.2 20.59,35.84 | 20.59,35.84 R10.2 | 20.59,35.84 20.98,35.45 20.98,34.53 v20.96,34.51 | v31.39,29.8 31.37,29.78 JP4.2 31.43,28.02 31.43,27.27 32.32,26.39 R5.2 33.91,25.22 34.35,24.77 34.35,24.64 34.56,24.43 34.74,24.25 34.88,24.25 35.29,23.85 v35.29,22.07 34.81,21.59 34.81,19.12 35.8,18.12 LED1.2 36.75,16.43 36.47,16.15 | C11.1 v23.45,11.41 | v23.45,11.41 26.32,11.41 R20.2 28.21,13.08 28.21,14.24 | R8.2 28.34,14.12 28.21,14.24 | 28.21,14.24 v28.21,16.15 | v35.84,16.15 36.47,16.15 | 36.47,16.15 37.49,16.15 C10.1 | R19.2 24.28,11.41 v23.45,11.41 | U$5.P3 7.38,30.42 6,31.79 6,36.46 v5.99,36.47 | v18.69,42.82 v28.21,42.82 37.74,42.82 40.91,39.64 40.91,34.3 39.24,32.62 U$17.P2 | 26.26,19.31 29.5,19.31 31.39,17.42 v31.39,16.15
  Bottom 0.127: 12.85,24.72 16.21,24.72 v16.47,24.47 | v24.92,22.88 24.62,22.58 24.62,21.6 v25.26,21.6 | v32.09,23.03 33.29,23.03 v33.98,23.72
  Bottom 0.508: U$2.P3 25.82,38.58 25.82,39.43 28.21,41.83 v28.21,42.82
  Bottom 0.61: v20.96,34.51 20.98,34.5 20.98,33.95 22.72,32.22 27.58,32.22 29.99,29.8 v31.39,29.8 33.35,29.8 36.16,32.62 U$17.P2 | U$12.P$1 6.77,29.21 U$5.P3 10.43,30.42 12.85,28 12.85,24.72 JP5.1 | SJ1.2 25.23,16.15 v28.21,16.15 v31.39,16.15 v35.84,16.15 | U$16.P3 21.23,7.32 21.23,9.67 22.97,11.41 v23.45,11.41 | v5.99,36.47 6.62,37.11 8.53,37.11 9.8,38.38 9.8,42.35 11.35,43.9 13.09,43.9 13.28,44.09 17.42,44.09 v18.69,42.82 | v35.29,22.07 36.2,22.07 36.58,21.69 X4.4
5V  (via drill 0.3)
  Top 0.508: v44.03,25.98 44.03,29.55 42.82,30.76 v42.82,33.93 | v9.85,37.06 9.18,37.06 8.82,36.71 8.82,36.27 U$5.P1 | v25.04,40.91 25.1,40.98 28.79,40.98 30.21,39.55 U$2.P1
  Top 0.61: v41.55,5.99 43.52,7.96 43.52,15.07 v43.96,15.52 | JP2.2 31.37,32.28 30.35,33.3 v30.12,33.3
  Bottom 0.406: 10.37,36.93 9.98,36.93 v9.85,37.06
  Bottom 0.508: v42.82,33.93 42.82,36.98 42.76,37.04 | 10.37,36.93 14.05,36.93 14.1,36.88 14.12,36.9 15.45,36.9 15.91,37.36 15.91,38.5 17.83,40.42 24.55,40.42 v25.04,40.91
  Bottom 0.61: v44.03,25.98 44.03,15.58 v43.96,15.52 | v41.55,5.99 39.01,3.45 18.05,3.45 16,5.51 U$16.P1 | 42.76,37.04 39.33,40.47 32.7,40.47 U$2.P1 30.12,37.89 v30.12,33.3
!RESET  (via drill 0.3)
  Top 0.127: 5.83,5.32 4.66,6.5 C12.2 4.66,8.47 v5.36,9.16 | 5.83,5.32 5.86,5.29 5.86,4.34 SW1.A' | SW1.A 9.99,4.34 9.42,4.34 7.32,6.43 R4.2 7.26,6.43 6.18,5.36 5.86,5.36 5.83,5.32 | v16.91,26.37 17.61,26.37 U$14.52
  Bottom 0.127: v16.91,26.37 16.91,21.74 JP5.10 9.16,13.99 6.37,13.99 U$12.P$4 5.36,12.97 v5.36,9.16
A0  (via drill 0.3)
  Top 0.127: U$14.3 19.38,19.62 19.5,19.5 19.5,18.75 20.5,17.75 20.5,12.5 19.5,11.5 16.98,11.5 16.98,10.63 v16.15,9.8 | v11.71,14.88 11.07,15.52 10.44,15.52 10.16,15.24 U$24.P2
  Bottom 0.127: v16.15,9.8 15.52,9.8 11.96,13.36 11.96,14.63 v11.71,14.88
A1  (via drill 0.3)
  Top 0.127: v23.75,18.25 24.88,19.38 24.88,19.5 U$14.14 | v24.75,17.25 24.38,16.88 24.38,15.43 19.66,10.72 18.28,10.72 v18.23,10.67 | v15.25,13.44 15.11,13.44 14.56,13.99 10.81,13.99 v10.31,13.48
  Bottom 0.127: v24.75,17.25 v23.75,18.25 | v18.23,10.67 18.02,10.67 v15.25,13.44 | v10.31,13.48 9.7,12.88 8.25,12.88 8.12,12.75 U$24.P3
A2_D16_HBLED
  Top 0.127: U$14.11 23.38,19.38 23.25,19.25 23.25,18.12 23.62,17.75 25.88,17.75 25.88,17.88 26.12,18.12 29.75,18.12 29.75,15.75 30.75,14.75 30.75,12.62 30,11.88 R7.2
AREF  (via drill 0.3)
  Top 0.127: U$14.4 19.88,19.38 22.88,16.38 23.5,16.38 C14.1 23.62,16.5 v23.62,17.25
  Bottom 0.127: v23.62,17.25 23.62,16.12 SJ1.1
D4_SHUTDOWN  (via drill 0.3)
  Top 0.127: v25.87,29.36 27.14,28.09 27.14,27.71 26.88,27.45 26.63,27.45 U$14.31 | v22.56,31.26 v23.96,31.26
  Bottom 0.127: v23.96,31.26 v25.87,29.36 | v22.56,31.26 21.04,32.79 12.78,32.79 11.51,31.52 6.47,31.52 4,29.04 4,24.05 5.34,22.7 7.76,22.7 U$5.P6
D5_HEALTH  (via drill 0.3)
  Top 0.127: v30.76,23.58 29.87,24.47 29.87,25.99 26.06,29.8 25.68,29.8 24.91,29.04 24.91,28.66 U$14.35 | v32.15,7.2 33.1,6.24 R1.2
  Bottom 0.127: v30.76,23.58 36.34,17.99 36.34,14.94 32.15,10.75 v32.15,7.2
D5_HEALTH_LED
  Top 0.127: D3.A 37.61,7.45 36.09,7.45 34.88,6.24 R1.1
D5_HEALTH_LED1
  Top 0.127: D1.A 37.61,11.51 35.64,11.51 33.74,13.42 32.41,13.42 31.71,14.12 R8.1
D6_SD_CS  (via drill 0.3)
  Top 0.127: v30.37,27.45 30.37,27.71 27.77,30.31 25.29,30.31 23.9,28.91 23.9,28.66 U$14.37
  Bottom 0.127: v30.37,27.45 31.5,27.45 31.5,27.5 34.5,24.5 34.75,24.5 34.75,21.25 35.38,20.62 38.25,20.62 39.38,19.5 X4.2
D7  (via drill 0.3)
  Top 0.127: v28.6,24.41 26.63,24.41 U$14.25
  Bottom 0.127: v28.6,24.41 29.61,25.42 X4.CD1
D8_NEOPIX  (via drill 0.3)
  Top 0.127: U$14.64 17.61,20.34 17.61,19.45 16.11,17.94 16.11,11.19 v16.03,11.12 | LED1.1 36.79,19.83 38.38,18.25 38.38,9.07 38.11,8.81 38.07,8.81 v37.61,8.35 | v17.18,9.67 17.5,9.35 21.5,9.35 21.5,8.12 22.38,7.25 22.38,6.62 23.12,5.88 30.02,5.88 31.11,4.78 35.9,4.78 v36.47,5.36
  Bottom 0.127: v17.18,9.67 16.03,10.81 v16.03,11.12 | v36.47,5.36 36.47,7.21 v37.61,8.35
D9_SD_BUSY_LED
  Top 0.127: U$14.38 23.39,28.66 23.39,28.91 25.04,30.56 27.9,30.56 30.82,27.64 30.82,26.37 31.58,25.61 31.58,24.59 32.79,23.39 33.04,23.39 33.42,23.01 33.42,14.12 R2.2
D10_INTA
  Top 0.127: U$14.41 21.86,28.66 21.86,30.69 17.67,34.88 17.67,37.93 U$2.P6
D11_INTB  (via drill 0.3)
  Top 0.127: v21.36,26.88 21.36,28.6 U$14.42
  Bottom 0.127: v21.36,26.88 21.36,11.51 19.64,9.8 19.64,6.5 20.54,5.6 27,5.6 28.47,7.07 U$16.P6
D12_SDA  (via drill 0.3)
  Top 0.127: U$14.43 20.86,30.63 v21.04,30.81 | 20.85,32.91 20.85,32.98 18.5,35.33 18.5,35.84 R9.1 | 20.85,32.91 v20.85,32.34 | v14.46,26.64 11.08,26.64 9.86,25.42 8.02,25.42 U$5.P5 | 20.85,32.91 v23.01,32.91
  Bottom 0.127: v20.85,32.34 20.96,32.23 20.96,30.88 v21.04,30.81 20.75,30.51 19,30.51 15.12,26.64 v14.46,26.64 | v23.01,32.91 23.14,32.79 30.37,32.79 30.63,33.04 30.63,34.18 34.06,37.61 37.42,37.61 U$17.P4
D13_SCL  (via drill 0.3)
  Top 0.127: U$14.44 20.38,31.8 16.63,35.54 | 16.63,35.54 16.59,35.58 16.59,38.44 17.23,39.07 20.66,39.07 21.61,38.12 21.61,37.49 23.26,35.84 R10.1 | v10.8,31.94 10.8,31.7 8.02,28.91 8.02,27.96 U$5.P4 | 16.63,35.54 v15.03,35.54 | v29.87,32.24 29.87,32.28 v27.58,34.56
  Top 0.152: R10.1 23.69,36.18 v24.29,36.18
  Bottom 0.127: v15.03,35.54 11.43,31.94 v10.8,31.94 | v29.87,32.24 33.77,32.24 36.6,35.07 37.42,35.07 U$17.P3
  Bottom 0.152: v24.29,36.18 25.55,34.92 27.22,34.92 v27.58,34.56
D14_HB_LED
  Top 0.127: R7.1 31.9,12.06 34.68,12.06 37.19,9.55 37.61,9.55 HB_LED.A
D_N
  Top 0.152: X3.D- 10.45,38.4 10.8,38.4 19.87,29.33 U$14.45
D_P
  Top 0.152: X3.D+ 9.8,38.4 9.98,38.4 9.98,38.28 10.15,38.12 10.69,38.12 19.37,29.43 U$14.46
EN
  Top 0.61: R3.1 37.65,22.63 U2.3
GND  (via drill 0.3)
  Top 0.254: U$14.22 26.22,22.9 25.81,22.49 25.3,22.49 v25.09,22.28 25.09,22.11 24.78,21.8 24.78,21.33 v24.46,21.01
  other vias: 9.8,28.21 6.62,26.95 4.72,26.95 4.72,21.86 9.61,24.85 11.34,24.63 11.45,23.07 10.37,23.77 10.18,31.97 9.5,31.09 10.74,31.03 15.21,31.2 15.21,29.29 17.12,29.29 19.02,27.39 19.02,24.85 15.31,25.69 9.6,26.32 18.79,22.6 18.79,21.34 19.16,20.68 23.19,21.01 23.19,22.92 20.65,22.92 20.65,25.46 23.82,24.82 23.19,27.36 24.25,27.39 28.09,27.11 27.63,25.46 28.86,23.17 27.5,21.37 28.77,21.37 31.72,23.59 34.27,23.03 32.75,24.04 33.64,24.56 35.01,24.91 33.52,26.26 34.84,27.08 33.71,28.85 29.9,31.49 33.4,32.93 35.21,30.44 36,33.49 36,36.66 39.81,36.03 39.81,34.12 39.81,32.22 42.99,29.04 42.78,25.57 42.19,23.53 42.19,20.99 37.73,17.13 39.3,17.24 37.96,19.69 35.47,21.15 34.63,18.33 35.26,17.06 33.99,17.06 32.72,17.7 32.72,18.97 30.18,17.7 27.62,18.58 26.37,17.7 22,15.87 23.91,13.97 26.45,13.97 25.18,13.97 28.35,11.43 28.35,8.89 30.26,8.89 35.97,12.06 36.61,8.89 34.7,7.62 37.24,5.71 41.05,12.06 41.05,9.52 39.15,14.6 37.24,14.6 28.99,15.24 32.16,15.24 35.26,15.16 32.72,12.62 31.45,10.71 32.72,7.54 31.45,6.27 32.09,4.36 33.99,4.36 32.09,1.19 35.26,12.62 36.43,10.97 37.77,10.49 39.04,6.04 43.48,6.04 41.58,15.57 41.58,18.74 22,18.41 22,20.95 18.54,16.9 17.64,18.16 19.31,18.17 18.54,14.99 18.54,13.09 18.54,10.17 15.24,11.6 12.7,11.6 13.03,13.23 13.03,15.77 14.93,15.77 9.85,16.4 9.85,11.96 6.04,11.96 3.5,11.32 7.95,4.34 11.76,4.34 19.38,4.97 22.26,6.13 24.76,6.37 25.37,8.57 22.2,8.57 20.4,8.57 25.48,10.47 29.29,10.47 29.29,13.01 22,14.6 28.98,17.57 31.25,18.65 38.54,8.31 41.08,8.31 44.32,8.71 44.32,11.88 43.05,18.87 44.26,31.58 44.26,36.03 41.72,36.66 41.72,39.84 38.54,39.2 37.27,41.74 38.54,44.28 31.56,41.74 31.56,43.65 26.48,43.65 26.48,41.74 21.4,43.65 21.4,41.74 16.32,43.01 9.33,43.65 9.97,43.65 4.89,44.28 8.99,40.51 10.89,40.51 11.53,41.78 9.52,36.37 5.01,37.38 6.7,34.23 3.11,34.21 14.37,33.63 15.79,32.22 18.33,32.22 17.06,33.49 15.91,36.11 15.98,34.67 18.61,34.59 17.09,36.05 22.28,34.62 23.87,38.82 34.4,29.45 36.3,27.53 29.15,34.31 25.78,34.2 24.51,34.2 27.17,29.48 23.36,29.56 22.39,30.3 21.37,29.89 24.65,31.26 26.89,31.31 28.33,28.27 29.82,26.89 25.73,25.95 25.73,25.32 24.74,18.44 23.71,18.92 20.9,18.97 20.93,17.52 20.93,15.62 20.93,13.71 22.02,12.47 18.51,8.73 15.6,14.44 16.07,22.08 15.08,21 14.45,27.3 11.22,25.95 13.18,34.69 14.18,36.05 17.69,30.34 20.7,21.26 29.02,41.74 27.83,40.34 29.28,39.42 30.81,39.91 33.42,39.4 31.91,38.15 26.6,39 26.26,37 23.44,36.79 31.34,21.4 32.72,20.24 31.39,19.83 18.98,38.63 18.7,36.91 20.9,36.81 21.66,39.07 19.91,34.9 18.61,29.46 19.79,30.08 19.9,27.25 19.26,24.07 19.26,25.98 13.93,17.69 5.67,8.16 3.77,8.16 4.4,4.99 4.8,34.23 11.76,7.51 14.93,6.24 14.93,4.97 17.25,6.04 17.89,4.77 20.01,2.43 22.55,2.43 23.19,4.97 25.73,1.8 33.97,5.36 36.61,4.44 35.97,2.54 35.91,10.22 39.67,10.49 36.5,13.03 41.58,14.3 35.66,19.66 34.02,19.41 27.54,16.82 9.24,34.23 6.93,36.28 7.78,38.46 33.24,30.65 36.33,23.54 7.76,2.59 2.87,19.58 15.57,41.17 2.23,36.72 23.27,12.7 24.54,12.7 25.81,12.7 27.08,14.6 27.62,19.97 28.14,21.37 33.93,22.09 33.93,21.46 31.78,34.44 34.32,36.98 35.37,41.74 33.46,41.74 39.81,43.01 36,44.28 43.62,38.57 39.81,3.01 2.98,16.98 2.98,13.8 2.98,30.95
  pour Top: -16.23,49.74 -16.23,-7.03 56.54,-7.03 56.54,49.74
  pour Bottom: 68.03,-10.84 -9.31,-10.84 -9.31,56.79 68.03,56.79
MISO  (via drill 0.3)
  Top 0.127: v20.91,27.9 U$14.49 | v23.39,30.37 24.47,30.37 24.91,30.82 32.41,30.82 36.45,26.78 v36.57,26.78
  Bottom 0.127: v23.39,30.37 v20.91,27.9 | v36.57,26.78 36.6,26.8 37.75,26.8 39.52,25.04 39.84,25.04 X4.7
MOSI  (via drill 0.3)
  Top 0.127: v18.37,26.95 17.93,27.39 U$14.50 | v14.41,12.61 14.41,9.33 v14.24,9.16 | v15.52,3.45 24.41,3.45 25.77,4.81 28.21,4.81 v28.36,4.95
  Bottom 0.127: X4.3 39.9,20.53 40.85,19.58 40.85,14.44 31.54,5.13 28.53,5.13 v28.36,4.95 | v18.37,26.95 18.37,20.91 14.19,16.73 14.19,12.82 v14.41,12.61 | v15.52,3.45 14.24,4.72 v14.24,9.16
N$1
  Top 0.127: D2.A 37.61,13.55 35.71,13.55 35.14,14.12 R2.1
N$5
  Top 0.127: U$14.1 18.31,19.64 18.31,17.67 17.36,16.72 X2.P$1 17.36,16.66 17.36,14.82 C2.1
N$7
  Top 0.127: U$14.2 18.88,19.64 18.88,17.55 19.71,16.72 X2.P$2 19.71,16.66 C4.1
N$11
  Top 0.127: U$14.55 17.61,24.91 14.63,24.91 13.67,25.87 12.91,25.87 L2.P$2
OUT  (via drill 0.3)
  Top 0.305: C7.1 43.45,24.47 42.25,24.47 U2.5
  Top 0.61: U2.5 41.68,24.81 C8.1 41.68,27.45 v40.91,28.21 | JP4.1 34.3,28.09 v34.34,28.13
  Bottom 0.61: v40.91,28.21 40.83,28.3 34.51,28.3 v34.34,28.13
QSPI_CS
  Top 0.127: R5.1 30.63,25.17 31.2,24.59 31.2,23.39 30.88,23.07 30.31,23.07 U1.1 30.25,23.07 29.42,23.9 26.63,23.9 U$14.24
QSPI_DATA[0]
  Top 0.127: U1.5 32.7,21.22 31.88,20.41 26.63,20.41 U$14.17
QSPI_DATA[1]
  Top 0.127: U$14.18 26.62,20.85 30.31,20.85 30.76,21.29 30.76,22.31 30.56,22.5 30.31,22.5 U1.2
QSPI_DATA[2]
  Top 0.127: U1.3 30.25,22.05 27.45,22.05 26.82,21.42 26.63,21.42 U$14.19
QSPI_DATA[3]  (via drill 0.3)
  Top 0.127: v31.14,22.56 32.66,22.56 U1.7 | v28.41,22.56 27.52,22.56 26.88,21.93 26.63,21.93 U$14.20
  Bottom 0.127: v28.41,22.56 v31.14,22.56
QSPI_SCK  (via drill 0.3)
  Top 0.127: v31.52,22.12 32.66,22.12 U1.6 | v27.33,23.01 27.2,23.01 26.82,23.39 26.63,23.39 U$14.23
  Bottom 0.127: v31.52,22.12 28.21,22.12 v27.33,23.01
SCK  (via drill 0.3)
  Top 0.127: v29.55,27.9 27.39,30.06 25.55,30.06 24.41,28.91 24.41,28.66 U$14.36 | v36.61,25.68 v34.95,25.68
  Bottom 0.127: v29.55,27.9 32.72,27.9 v34.95,25.68 | v36.61,25.68 38.09,24.19 X4.5
SCL  (via drill 0.3)
  Top 0.127: R19.1 24.41,8.02 23.52,7.13 U$16.P4 | U$14.30 26.55,26.92 v25.84,26.92
  Bottom 0.127: 25.8,27.39 25.8,28.66 22.75,31.71 22.5,31.71 20.34,33.87 20.34,35.58 22.69,37.93 U$2.P4 | 25.8,27.39 25.66,27.39 22.56,24.29 22.56,12.34 19.9,9.67 19.9,6.62 20.53,5.99 21.48,5.99 22.56,7.07 23.45,7.07 U$16.P4 | v25.84,26.92 25.8,26.96 25.8,27.39
SDA  (via drill 0.3)
  Top 0.127: U$16.P5 26.06,7.13 26.44,7.51 v26.44,8.58 R20.1 | v25.29,31.26 23.2,33.36 20.85,33.36 19.39,34.82 19.39,36.41 20.15,37.17 20.15,37.93 U$2.P5 | v25.73,23.88 25.73,23.08 v25.61,22.97 | v26,17.25 26,14.62 v25.85,14.47
  Top 0.152: U$14.29 27.27,26.4 v27.3,26.37
  Bottom 0.127: v25.29,31.26 25.29,30.56 26.31,29.55 26.31,26.37 v27.3,26.37 27.57,26.11 27.92,26.11 28.19,25.84 28.19,25.22 26.91,23.93 25.73,23.93 v25.73,23.88 | v25.61,22.97 25.68,22.91 25.68,20 25.62,20 25.62,17.62 v26,17.25 | v25.85,14.47 26.03,14.29 26.03,13.79 26.44,13.39 v26.44,8.58
SWCLK  (via drill 0.3)
  Top 0.127: 15.26,23.9 17.61,23.9 U$14.57 | JP5.4 15.26,23.9 | 15.26,23.9 14.09,25.07 10.84,25.07 9.48,23.71 9.48,22.12 9.61,21.99 9.61,21.17 9.65,21.08
  Top 0.254: v9.16,20.59 9.65,21.08 R6.2
  Bottom 0.254: U$12.P$3 6.62,20.59 v9.16,20.59
SWDIO  (via drill 0.3)
  Top 0.127: v15.45,23.45 17.61,23.45 U$14.58 | v12.09,24.53 12.34,24.53 12.53,24.72 13.42,24.72 JP5.2
  Bottom 0.127: v15.45,23.45 14.69,23.45 JP5.2 | v12.09,24.53 11.77,24.21 6.43,24.21 U$12.P$2
VBUS  (via drill 0.3)
  Top 0.305: 32.47,31.71 JP2.1 | C6.1 30.77,35.85
  Top 0.406: X3.VBUS 11.59,38.89 12.48,37.99 15.02,37.99 16.98,39.95 27.44,39.95 27.6,39.79 28.06,39.79 28.18,39.67 v28.24,39.67 | v30.76,40.91 32.66,39.01 32.66,37.74 30.77,35.85
  Top 0.508: 37.65,27.12 33.06,31.71 32.47,31.71
  Top 0.61: U2.1 37.65,24.53 | 37.65,24.53 R3.2 | 37.65,27.12 37.65,24.53 | JP2.1 32.11,31.9 32.11,32.65 30.94,33.82 C6.1
  Bottom 0.406: v28.24,39.67 29.48,40.91 v30.76,40.91
VDDCORE1
  Top 0.127: 13.67,29.99 13.67,31.84 C13.1 | 13.67,28.09 12.91,28.09 L2.P$1 13.67,28.09 | 13.67,28.09 14.4,28.09 16.56,25.93 17.61,25.93 U$14.53 | 13.67,28.09 13.67,29.99 | 13.67,29.99 C15.1

### Text on the board
sName: Port A | Service Only | RobotPatient.com | 5V: | Amplifier: | BP: | RobotPatient.com | Stereo Out: | SD Card | SD | PWR | HB | Health | Port B | Reset
_bPlace: Cortex M4 / SAMD51 | RobotPatient.com | Designed for / ManikinOS